# Altium schematic sheet RCservo_interface.SchDoc: APTOMAT - Power Supply
size A3; Revision: 1.1.1; SheetNumber: 5; SheetTotal: 5; DrawnBy: KJP; ProjectNumber: 4397; PCBRevision: 0071KJP; DocumentSize: A4; PCAName: PCA10040; PCBNumber: 400150; ProjectName: Quark
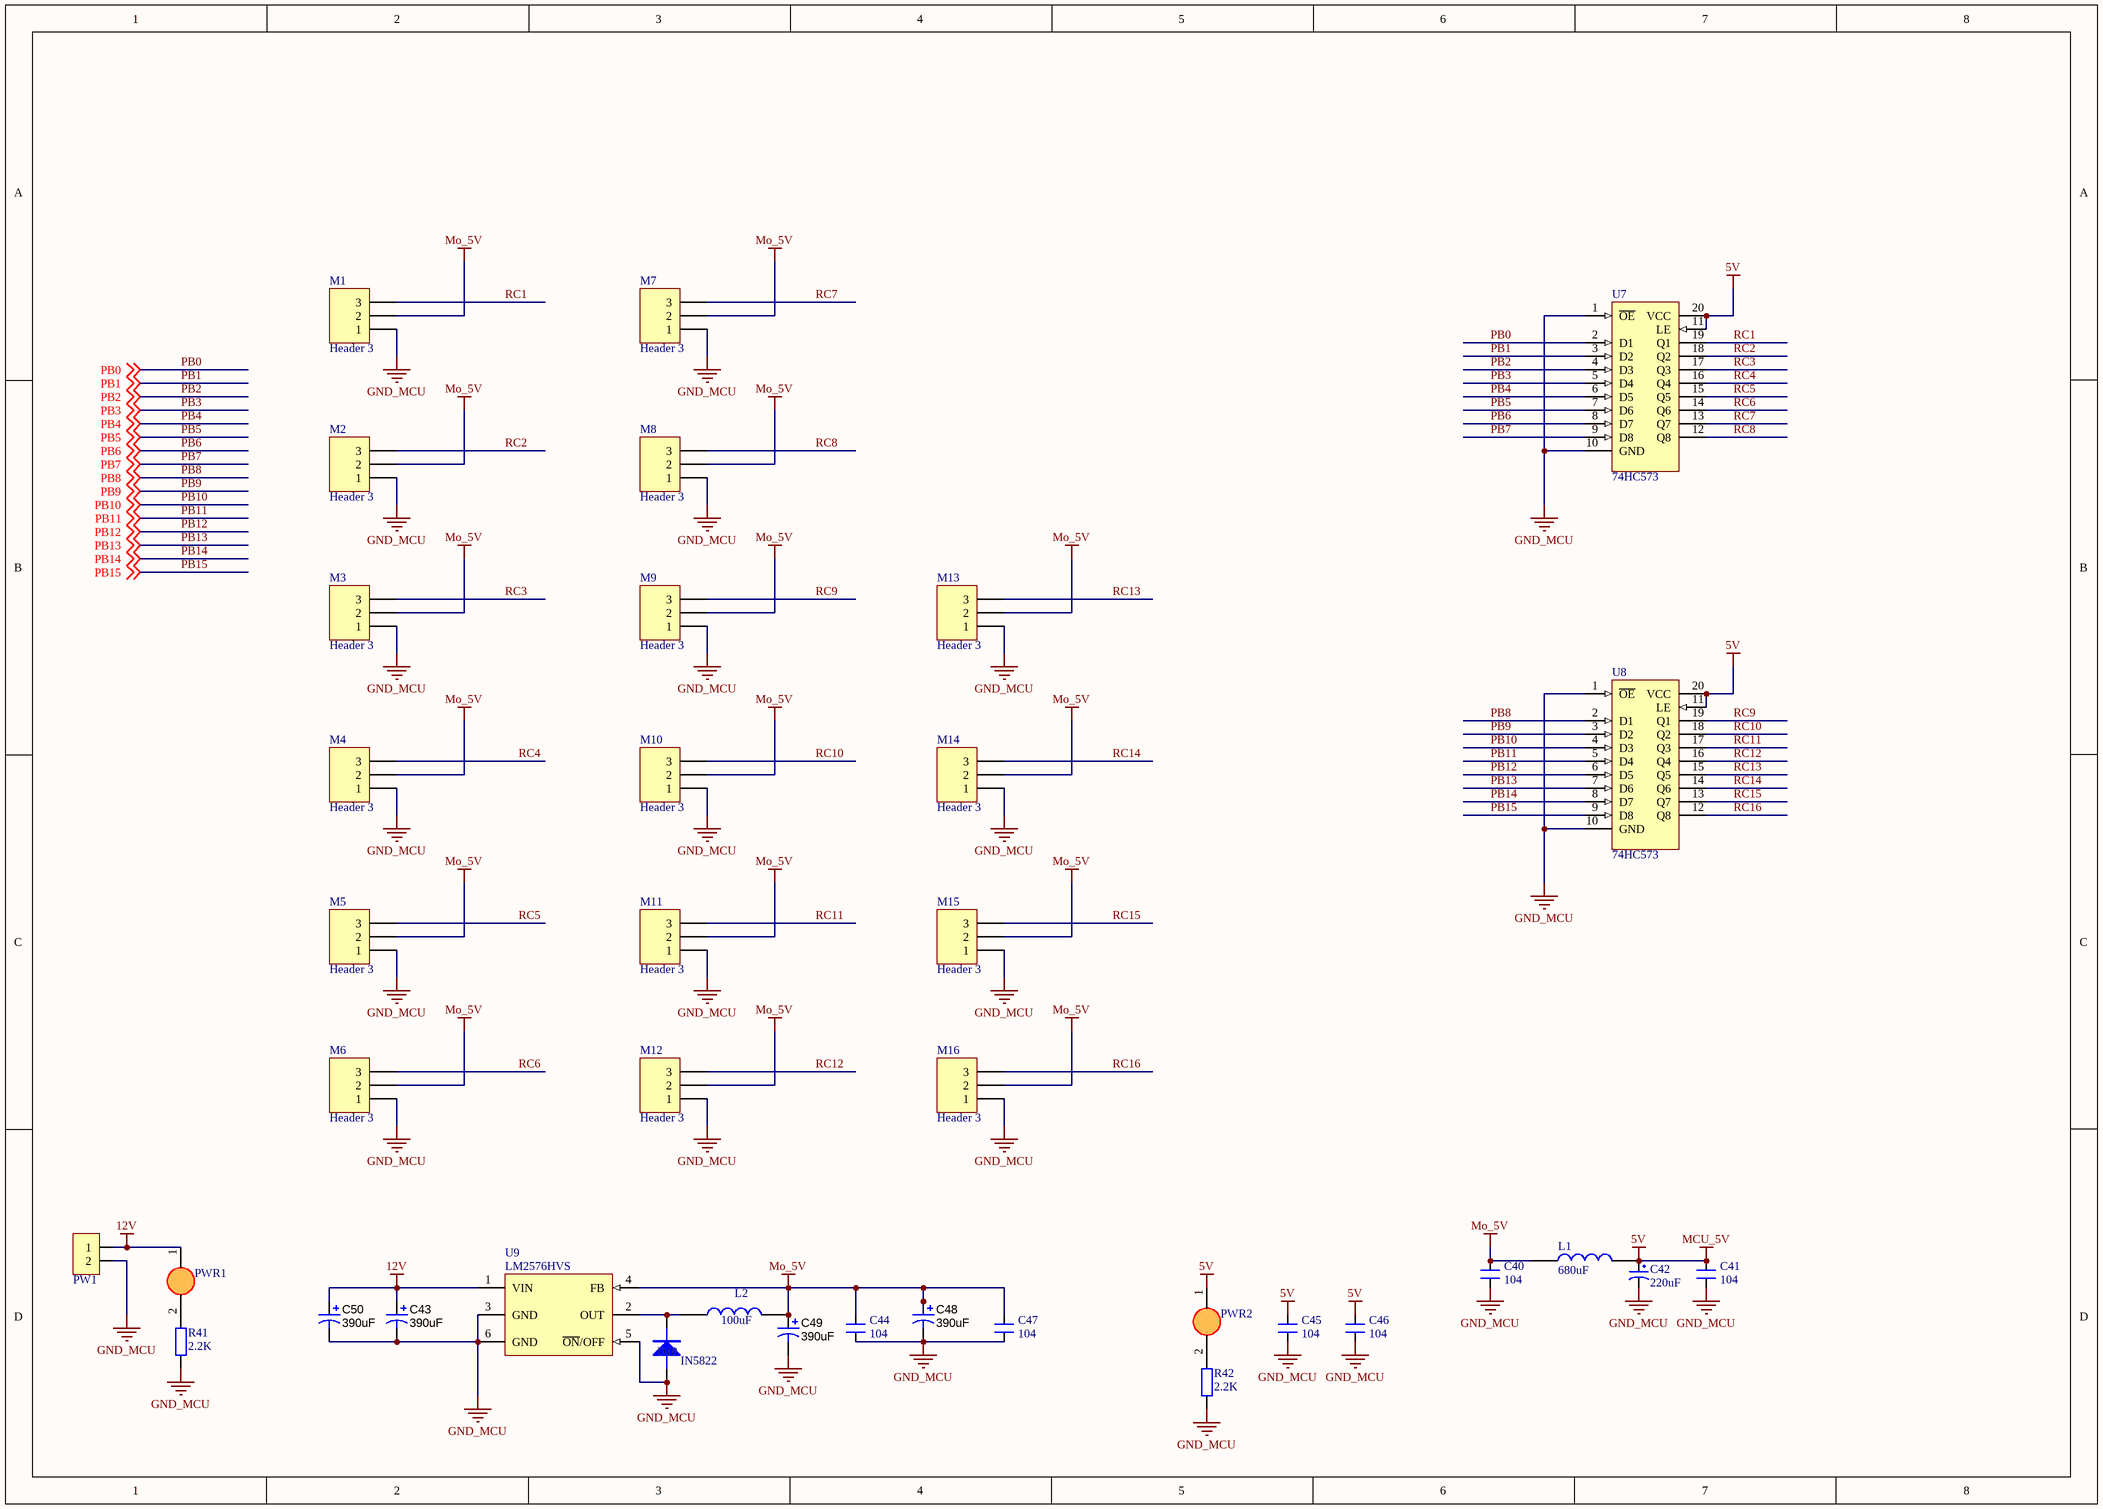
[diagram p0: RCservo_interface.SchDoc]

## Parts
C40  104  [0805_HV]
C41  104  [0805_HV]
C42  220uF  [TU_NHOM_2.5_MH]
C43  390uF  [CP1/3.0]
C44  104  [0805_HV]
C45  104  [0805_HV]
C46  104  [0805_HV]
C47  104  [0805_HV]
C48  390uF  [CP1/3.0]
C49  390uF  [CP1/3.0]
C50  390uF  [CP1/3.0]
D18  IN5822  [SOD123]
L1  680uF  [Inductor 4.5x5]
L2  100uF  [IND_2118-V-RC]
M1  Header 3  [HDR1X3]
M2  Header 3  [HDR1X3]
M3  Header 3  [HDR1X3]
M4  Header 3  [HDR1X3]
M5  Header 3  [HDR1X3]
M6  Header 3  [HDR1X3]
M7  Header 3  [HDR1X3]
M8  Header 3  [HDR1X3]
M9  Header 3  [HDR1X3]
M10  Header 3  [HDR1X3]
M11  Header 3  [HDR1X3]
M12  Header 3  [HDR1X3]
M13  Header 3  [HDR1X3]
M14  Header 3  [HDR1X3]
M15  Header 3  [HDR1X3]
M16  Header 3  [HDR1X3]
PW1  CON 2 EDG 5.08_MH  [CON 2 EDG 5.08]  (value not drawn)
PWR1  LED3  [LED_0805]  (value not drawn)
PWR2  LED3  [LED_0805]  (value not drawn)
R41  2.2K  [Tro SMD 0805]
R42  2.2K  [Tro SMD 0805]
U7  74HC573  [SOIC-20]
U8  74HC573  [SOIC-20]
U9  LM2576HVS  [TO263-5]

## Nets
5V: C41.2 C42.1 C45.2 C46.2 L1.2 PWR2.1(A) U7.11(LE) U7.20(VCC) U8.11(LE) U8.20(VCC)  [also labelled MCU_5V]
12V: C43.1(+) C50.1(+) PW1.1 PWR1.1(A) U9.1(VIN)
GND_MCU: C40.1 C41.1 C42.2 C43.2(-) C44.1 C45.1 C46.1 C47.1 C48.2(-) C49.2(-) C50.2(-) D18.1 M1.1 M2.1 M3.1 M4.1 M5.1 M6.1 M7.1 M8.1 M9.1 M10.1 M11.1 M12.1 M13.1 M14.1 M15.1 M16.1 PW1.2 R41.1 R42.1 U7.1(~{OE}) U7.10(GND) U8.1(~{OE}) U8.10(GND) U9.3(GND) U9.5(~{ON}/OFF) U9.6(GND)
Mo_5V: C40.2 C44.2 C47.2 C48.1(+) C49.1(+) L1.1 L2.2 M1.2 M2.2 M3.2 M4.2 M5.2 M6.2 M7.2 M8.2 M9.2 M10.2 M11.2 M12.2 M13.2 M14.2 M15.2 M16.2 U9.4(FB)
PB0: U7.2(D1) ; off-sheet PB0
PB1: U7.3(D2) ; off-sheet PB1
PB2: U7.4(D3) ; off-sheet PB2
PB3: U7.5(D4) ; off-sheet PB3
PB4: U7.6(D5) ; off-sheet PB4
PB5: U7.7(D6) ; off-sheet PB5
PB6: U7.8(D7) ; off-sheet PB6
PB7: U7.9(D8) ; off-sheet PB7
PB8: U8.2(D1) ; off-sheet PB8
PB9: U8.3(D2) ; off-sheet PB9
PB10: U8.4(D3) ; off-sheet PB10
PB11: U8.5(D4) ; off-sheet PB11
PB12: U8.6(D5) ; off-sheet PB12
PB13: U8.7(D6) ; off-sheet PB13
PB14: U8.8(D7) ; off-sheet PB14
PB15: U8.9(D8) ; off-sheet PB15
RC1: M1.3 U7.19(Q1)
RC2: M2.3 U7.18(Q2)
RC3: M3.3 U7.17(Q3)
RC4: M4.3 U7.16(Q4)
RC5: M5.3 U7.15(Q5)
RC6: M6.3 U7.14(Q6)
RC7: M7.3 U7.13(Q7)
RC8: M8.3 U7.12(Q8)
RC9: M9.3 U8.19(Q1)
RC10: M10.3 U8.18(Q2)
RC11: M11.3 U8.17(Q3)
RC12: M12.3 U8.16(Q4)
RC13: M13.3 U8.15(Q5)
RC14: M14.3 U8.14(Q6)
RC15: M15.3 U8.13(Q7)
RC16: M16.3 U8.12(Q8)
NetD18_2: D18.2 L2.1 U9.2(OUT)
NetPWR1_2: PWR1.2(K) R41.2
NetPWR2_2: PWR2.2(K) R42.2

## Library data of the parts
C40 C41 C44-C47 = CM: Cap SMD; Value: 103
C42 = TU_NHOM_220uF_25V_MH: LINK: https://item.taobao.com/item.htm?spm=a230r.1.14.282.6c612953FsebRk&id=546158429968&ns=1&abbucket=10#detail
C43 C48-C50 = Capacitor TuHoa: PartNumber: UHW1H391MPD6; Manufacturer: Nichicon; Polarized: Y; U/M: EA; Cap_F: 0.000390; Tolerance_%: 20; Value1: Unknown; VDC_V: 50; Value2: 50V; TaMin_C: -40; TaMax_C: 105; Cap_Case: 10x22; AEC Category: Q200; AEC Qualified: N; CompType: Capacitor; SymbolVersion: 2008-07-09; Value: 390uF; PackageReference: 10x22; RoHS: Y; MountType: TH; Technology: AL; Series: ZL; Publisher: Texas Instruments; LatestRevisionDate: 2015-12-17; ComponentLink1Description: Datasheet link; ComponentLink1URL: http://nichicon-us.com/english/products/pdfs/e-uhw.pdf; Supplier 1: Digi-Key; Supplier Part Number 1: 493-6885-ND; AEC Grade: N/A; ValueDisplayed: 390uF
D18 = Diode S4 SOD123 ( 1N5819 SOD123)_MH: Diode S4 SOD123 ( 1N5819 SOD123)
L1 = Inductor 4.5x5_MH
L2 = Inductor Lm2576_MH: cuon cam
M1-M16 = Header 3: Header, 3-Pin; LatestRevisionDate: 17-Jul-2002; LatestRevisionNote: Re-released for DXP Platform.; Publisher: Altium Limited
PW1 = CON 2 EDG 5.08_MH: CON 2 EDG 5.08 (xanh cong)
PWR1 PWR2 = LED SMD_0805_MH: LED 3mm
R41 R42 = TRO_SMD_0805_MH
U7 U8 = 74HC573 DIP20 IC Flip-Flop_MH: Octal D-Type Latch with 3-State Output Non-Inverting; Value: 74HC573; Copyright by: VanDungEvn@Gmail.com
U9 = LM2576HVS-5.0V BUCK 5V 3A TO263-5 _MH: PartNumber: LM2576T-5.0; Manufacturer: National Semiconductor; CompType: Switcher; PackageTopMarking: NSUZXYTT*LM2576T*-5.0 P+; PowerWise: N; FirstPublished: 4-Dec-2008; DatasheetVersion: Aug-2004; PackageVersion: revJ, Jan-1992; PackageReference: T05A; Publisher: Altium Limited; PackageDescription: TO-220, Molded, 5 Lead, Straight; RoHS: O; PinCount: 5; DigiKeyPartNumber: LM2576T-5.0-ND; Code_JEDEC: TO-220-AB; ComponentLink1Description: LM2576 Datasheet; ComponentLink1URL: http://www.national.com/ds/LM/LM2576.pdf; ComponentLink2Description: LM2576 Web Page; ComponentLink2URL: http://www.national.com/pf/LM/LM2576.html; ComponentLink3Description: T05A Package Page; ComponentLink3URL: http://www.national.com/packaging/folders/t05a.html